# EAGLE design lambda_bl49 (EAGLE 8.5.1)
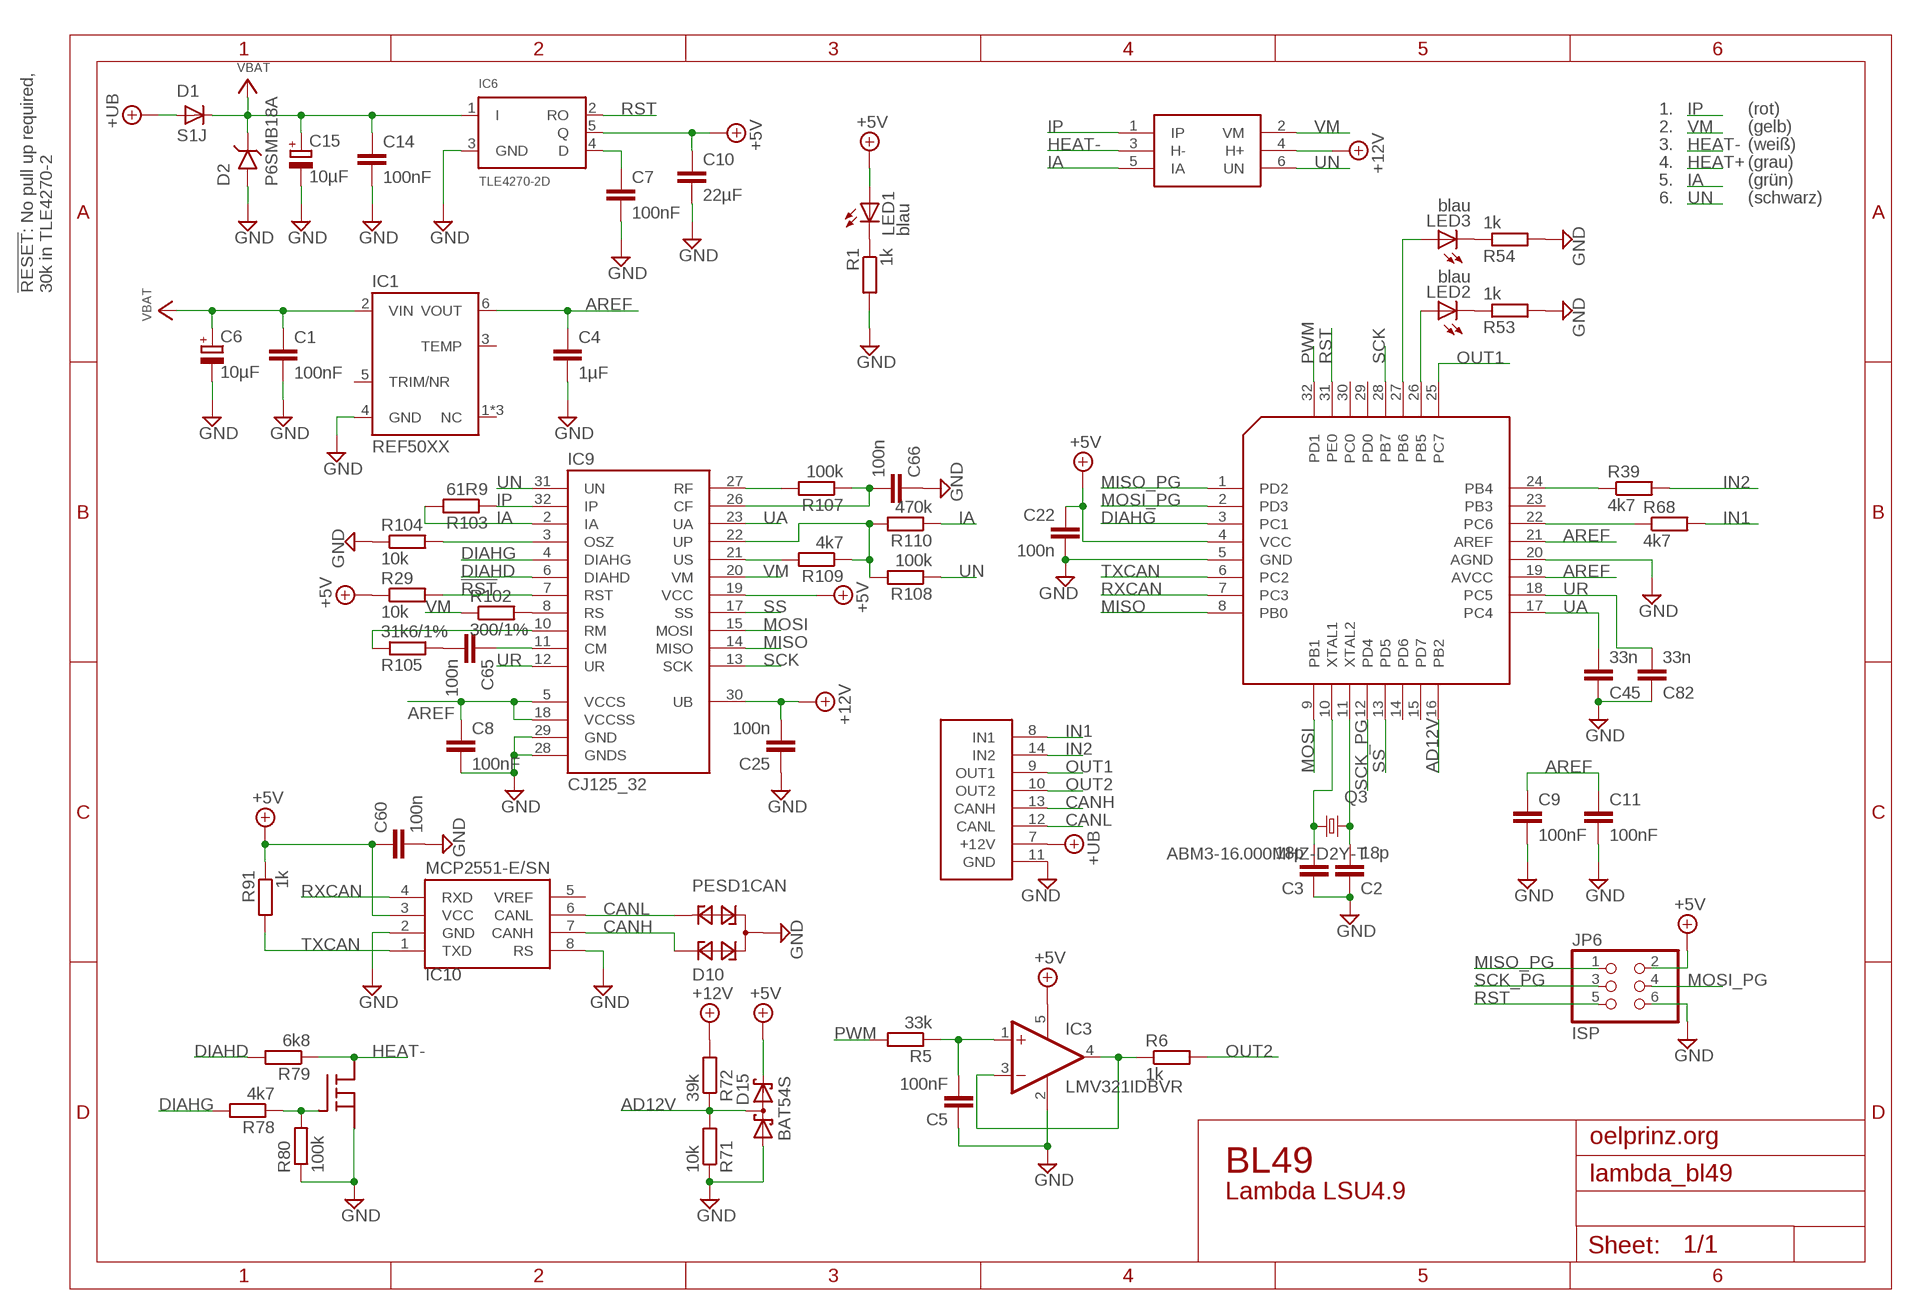
[diagram p0: schematic, sheet 1]

## Parts
C1  100nF  C-EUC0603  [C0603]
C2  18p  C-EUC0603  [C0603]
C3  18p  C-EUC0603  [C0603]
C4  1µF  C-EUC0603  [C0603]
C5  100nF  C-EUC0603  [C0603]
C6  10µF  CPOL-EUD  [PANASONIC_D]
C7  100nF  C-EUC0603  [C0603]
C8  100nF  C-EUC0603  [C0603]
C9  100nF  C-EUC0603  [C0603]
C10  22µF  C-EUC1206  [C1206]
C11  100nF  C-EUC0603  [C0603]
C14  100nF  C-EUC0603  [C0603]
C15  10µF  CPOL-EUD  [PANASONIC_D]
C22  100n  C-EUC0603  [C0603]
C25  100n  C-EUC0603  [C0603]
C45  33n  C-EUC0603  [C0603]
C60  100n  C-EUC0603  [C0603]
C65  100n  C-EUC0603  [C0603]
C66  100n  C-EUC0603  [C0603]
C82  33n  C-EUC0603  [C0603]
D1  S1J  DIODESMA  [SMADIODE]
D2  P6SMB18A  P6SMBXXASMB  [DO-214AA]
D10  PESD1CAN  [SOT23]
D15  BAT54S  [SOT23]
IC1  REF50XX  [SOIC127P600X175-8N]
IC3  LMV321IDBVR  LMV321M7  [SC70-5L]
IC6  TLE4270-2D  [TO252-51]
IC9  CJ125_32  [TQFP32-08]
IC10  MCP2551-E/SN  MCP255  [SOIC8]
JP6  ISP  PINHD-2X3  [2X03]
LED1  blau  LEDSML0805  [SML0805]
LED2  blau  LEDSML0805  [SML0805]
LED3  blau  LEDSML0805  [SML0805]
Q3  ABM3-16.000MHZ-D2Y-T  ABM3-8.000MHZ-D2Y-T  [ABM3]
R1  1k  R-EU_R0603  [R0603]
R5  33k  R-EU_R0603  [R0603]
R6  1k  R-EU_R0603  [R0603]
R29  10k  R-EU_R0603  [R0603]
R39  4k7  R-EU_R0603  [R0603]
R53  1k  R-EU_R0603  [R0603]
R54  1k  R-EU_R0603  [R0603]
R68  4k7  R-EU_R0603  [R0603]
R71  10k  R-EU_R0603  [R0603]
R72  39k  R-EU_R0603  [R0603]
R78  4k7  R-EU_R0603  [R0603]
R79  6k8  R-EU_R0603  [R0603]
R80  100k  R-EU_R0603  [R0603]
R91  1k  R-EU_R0603  [R0603]
R102  300/1%  R-EU_R0603  [R0603]
R103  61R9  R-EU_R0603  [R0603]
R104  10k  R-EU_R0603  [R0603]
R105  31k6/1%  R-EU_R0603  [R0603]
R107  100k  R-EU_R0603  [R0603]
R108  100k  R-EU_R0603  [R0603]
R109  4k7  R-EU_R0603  [R0603]
R110  470k  R-EU_R0603  [R0603]
U$1  BL49  [BL49]
U$2  ATMEGA32M1-AU  AT32M1  [TQFP32-08]
U$3  STD30NF06LT4  IRLZ44  [DPACK_2]

## Nets
!RST: IC9.7(RST) R29.2
+5V: C10.1 C22.1 C60.1 D15.2(C2) IC3.5(V+) IC6.5(Q) IC9.19(VCC) IC10.3(VCC) JP6.2 LED1.A R29.1 R91.1 U$2.4(VCC)
+12V: C25.2 IC9.30(UB) R72.2 U$1.4(H+)
+UB: D1.A U$1.7(+12V)
AD12V: D15.3(C1A2) R71.2 R72.1 U$2.16(PB2)
AREF: C4.1 C8.1 C9.1 C11.1 IC1.6(VOUT) IC9.5(VCCS) IC9.18(VCCSS) U$2.19(AVCC) U$2.21(AREF)
CANH: D10.1 IC10.7(CANH) U$1.13(CANH)
CANL: D10.2 IC10.6(CANL) U$1.12(CANL)
DIAHD: IC9.6(DIAHD) R79.2
DIAHG: IC9.4(DIAHG) R78.2 U$2.3(PC1)
GND: C1.2 C2.1 C3.1 C4.2 C5.1 C6.- C7.2 C8.2 C9.2 C10.2 C11.2 C14.2 C15.- C22.2 C25.1 C45.1 C60.2 C66.1 C82.1 D2.P$2(A) D10.3 D15.1(A1) IC1.4(GND) IC3.2(V-) IC6.3(GND) IC9.28(GNDS) IC9.29(GND) IC10.2(GND) IC10.8(RS) JP6.6 R1.2 R53.2 R54.2 R71.1 R80.1 R104.1 U$1.11(GND) U$2.5(GND) U$2.20(AGND) U$3.S
HEAT-: R79.1 U$1.3(H-) U$3.D
IA: IC9.2(IA) R103.2 R110.1 U$1.5(IA)
IN1: R68.2 U$1.8(IN1)
IN2: R39.2 U$1.14(IN2)
IP: IC9.32(IP) R103.1 U$1.1(IP)
MISO: IC9.14(MISO) U$2.8(PB0)
MISO_PG: JP6.1 U$2.1(PD2)
MOSI: IC9.15(MOSI) U$2.9(PB1)
MOSI_PG: JP6.4 U$2.2(PD3)
N$1: IC9.3(OSZ) R104.2
N$2: LED1.C R1.1
N$10: C7.1 IC6.4(D)
N$11: IC9.10(RM) R105.1
N$12: C5.2 IC3.1(+IN) R5.1
N$14: IC3.3(-IN) IC3.4(OUT) R6.1
N$16: C2.2 Q3.1 U$2.11(XTAL2)
N$20: C65.1 IC9.11(CM)
N$21: C3.2 Q3.2 U$2.10(XTAL1)
N$26: C65.2 R105.2
N$27: IC9.8(RS) R102.2
N$33: R39.1 U$2.24(PB4)
N$34: LED2.A U$2.26(PB5)
N$36: LED2.C R53.1
N$37: LED3.C R54.1
N$38: LED3.A U$2.27(PB6)
N$42: R68.1 U$2.22(PC6)
N$44: IC9.27(RF) R107.2
N$49: IC9.22(UP) R108.2 R109.1 R110.2
N$50: IC9.21(US) R109.2
N$51: R78.1 R80.2 U$3.G
N$52: C66.2 IC9.26(CF) R107.1
OUT1: U$1.9(OUT1) U$2.25(PC7)
OUT2: R6.2 U$1.10(OUT2)
PWM: R5.2 U$2.32(PD1)
RST: IC6.2(RO) JP6.5 U$2.31(PE0)
RXCAN: IC10.4(RXD) U$2.7(PC3)
SCK: IC9.13(SCK) U$2.28(PB7)
SCK_PG: JP6.3 U$2.12(PD4)
SS: IC9.17(SS) U$2.13(PD5)
TXCAN: IC10.1(TXD) R91.2 U$2.6(PC2)
UA: C45.2 IC9.23(UA) U$2.17(PC4)
UN: IC9.31(UN) R108.1 U$1.6(UN)
UR: C82.2 IC9.12(UR) U$2.18(PC5)
VBAT: C1.1 C6.+ C14.1 C15.+ D1.C D2.P$1(C) IC1.2(VIN) IC6.1(I)
VM: IC9.20(VM) R102.1 U$1.2(VM)
Unconnected: IC1.1(NC) IC1.3(TEMP) IC1.5(TRIM/NR) IC1.7(NC) IC1.8(NC) IC10.5(VREF) U$2.14(PD6) U$2.15(PD7) U$2.23(PB3) U$2.29(PD0) U$2.30(PC0)

## Notes on the sheet
- 1. | (rot)
- 2. | (gelb)
- 3. | (weiß)
- 4. | (grau)
- 5. | (grün)
- 6. | (schwarz)
- !RESET!: No pull up required, 
  30k in TLE4270-2
- BL49 | oelprinz.org
- Lambda LSU4.9

## Library data of the parts
C1 C4 C7-C11 C14 C25 = rcl:C-EU: CAPACITOR, European symbol; SPICEPREFIX: C
C2 C3 C5 C22 C45 C60 C65 C66 C82 = rcl:C-EU: CAPACITOR, European symbol
C6 C15 = rcl:CPOL-EU: POLARIZED CAPACITOR, European symbol; SPICEPREFIX: C
D1 = Heinrich:DIODE: Diode SMADIODE - SMA Surface Mount Package 20V 1A Schottky Diode Digikey (500mV @ 1A, 500uA Vr @ 20V): 641-1014-6-ND SOD-123 30V 500mA (430mV Vf, 130uA Vr @ 30V) Schottky Diode - Digikey: B0530W-FDICT-ND SOD-323 10V 570mA (380mV Vf, 3ns) Schottky Diode - Digikey: ZLLS410CT-ND SOD-523 30V 30mA Schottky Diode (RB751S-40TE61) - Digikey: RB751S-40TE61CT-ND SOT23-R/W - SOT23 Package (R = Solder Paste/Reflow Ovens, W = Hand-Soldering) BAT54Film 40V 300mA - Digikey: 497-7162-1-ND DO-1N4148 Through Hole Small Current Diode (any model)
D2 = Heinrich:P6SMBXXA: SMBxxAT3G TVS Diode The SMB series is designed to protect voltage sensitive components from high voltage, high energy transients. They have excellent clamping capability, high surge capability, low zener impedance and fast response time. The SMB series is supplied in ON Semiconductor?s exclusive, cost-effective, highly reliable SURMETIC? package and is ideally suited for use in communication systems, automotive, numerical controls, process controls, medical equipment, business machines, power supplies and many other industrial/consumer applications. http://www.onsemi.com/pub_link/Collateral/P6SMB6.8AT3-D.PDF <datasheet.pdf>
D10 = diode:PESD1CAN: CAN bus ESD protection diode Source: http://www.nxp.com/documents/data_sheet/PESD1CAN.pdf
D15 = diode:BAT54S: Schottky Diodes Pin connection corrected 2011-05-04 Source: Fairchild .. BAT54.pdf
IC1 = Heinrich:REF50XX: 3 Vpp/V Noise, 3 ppm/C Drift Precision Series Voltage Reference Source: Datasheet <http://www.ti.com/general/docs/lit/getliterature.tsp?genericPartNumber=REF5050&fileType=pdf>; DESCRIPTION: 3 Vpp/V Noise, 3 ppm/C Drift Precision Series Voltage Reference; HEIGHT: 1.75mm; MANUFACTURER_NAME: Texas Instruments; MANUFACTURER_PART_NUMBER: REF5050AIDR; MOUSER_PART_NUMBER: 595-REF5050AIDR; MOUSER_PRICE-STOCK: https://www.mouser.com/Search/Refine.aspx?Keyword=595-REF5050AIDR
IC3 = linear:LMV321?*: General Purpose, Low Voltage, Rail-to-Rail Output Operational Amplifiers Source: http://www.national.com/mpf/LM/LMV321.html http://www.national.com/dt/lmv_qual.pdf
IC6 = Heinrich:TLE4270-2
IC9 = cj125:CJ125_32
IC10 = MCP255:MCP255
JP6 = pinhead:PINHD-2X3: PIN HEADER
LED1-LED3 = led:LED: LED OSRAM: - CHIPLED LG R971, LG N971, LY N971, LG Q971, LY Q971, LO R971, LY R971 LH N974, LH R974 LS Q976, LO Q976, LY Q976 LO Q996 - Hyper CHIPLED LW Q18S LB Q993, LB Q99A, LB R99A - SideLED LS A670, LO A670, LY A670, LG A670, LP A670 LB A673, LV A673, LT A673, LW A673 LH A674 LY A675 LS A676, LA A676, LO A676, LY A676, LW A676 LS A679, LY A679, LG A679 - Hyper Micro SIDELED® LS Y876, LA Y876, LO Y876, LY Y876 LT Y87S - SmartLED LW L88C, LW L88S LB L89C, LB L89S, LG L890 LS L89K, LO L89K, LY L89K LS L896, LA L896, LO L896, LY L896 - TOPLED LS T670, LO T670, LY T670, LG T670, LP T670 LSG T670, LSP T670, LSY T670, LOP T670, LYG T670 LG T671, LOG T671, LSG T671 LB T673, LV T673, LT T673, LW T673 LH T674 LS T676, LA T676, LO T676, LY T676, LB T676, LH T676, LSB T676, LW T676 LB T67C, LV T67C, LT T67C, LS T67K, LO T67K, LY T67K, LW E67C LS E67B, LA E67B, LO E67B, LY E67B, LB E67C, LV E67C, LT E67C LW T67C LS T679, LY T679, LG T679 LS T770, LO T770, LY T770, LG T770, LP T770 LB T773, LV T773, LT T773, LW T773 LH T774 LS E675, LA E675, LY E675, LS T675 LS T776, LA T776, LO T776, LY T776, LB T776 LHGB T686 LT T68C, LB T68C - Hyper Mini TOPLED® LB M676 - Mini TOPLED Santana® LG M470 LS M47K, LO M47K, LY M47K Source: http://www.osram.convergy.de LUXEON: - LUMILED® LXK2-PW12-R00, LXK2-PW12-S00, LXK2-PW14-U00, LXK2-PW14-V00 LXK2-PM12-R00, LXK2-PM12-S00, LXK2-PM14-U00 LXK2-PE12-Q00, LXK2-PE12-R00, LXK2-PE12-S00, LXK2-PE14-T00, LXK2-PE14-U00 LXK2-PB12-K00, LXK2-PB12-L00, LXK2-PB12-M00, LXK2-PB14-N00, LXK2-PB14-P00, LXK2-PB14-Q00 LXK2-PR12-L00, LXK2-PR12-M00, LXK2-PR14-Q00, LXK2-PR14-R00 LXK2-PD12-Q00, LXK2-PD12-R00, LXK2-PD12-S00 LXK2-PH12-R00, LXK2-PH12-S00 LXK2-PL12-P00, LXK2-PL12-Q00, LXK2-PL12-R00 Source: www.luxeon.com KINGBRIGHT: KA-3528ASYC Source: www.kingbright.com
Q3 = ABM3:ABM3-8.000MHZ-D2Y-T
R1 R5 R6 R29 R39 R53 R54 R68 R71 R72 R78-R80 R91 R102-R105 R107-R110 = rcl:R-EU_: RESISTOR, European symbol
U$1 = bl49:BL49
U$2 = AT32M1:AT32M1
U$3 = irlz44:IRLZ44

## Net classes
1 +5V: width 0.381 mm
2 +3V3: width 0.229 mm

## Board
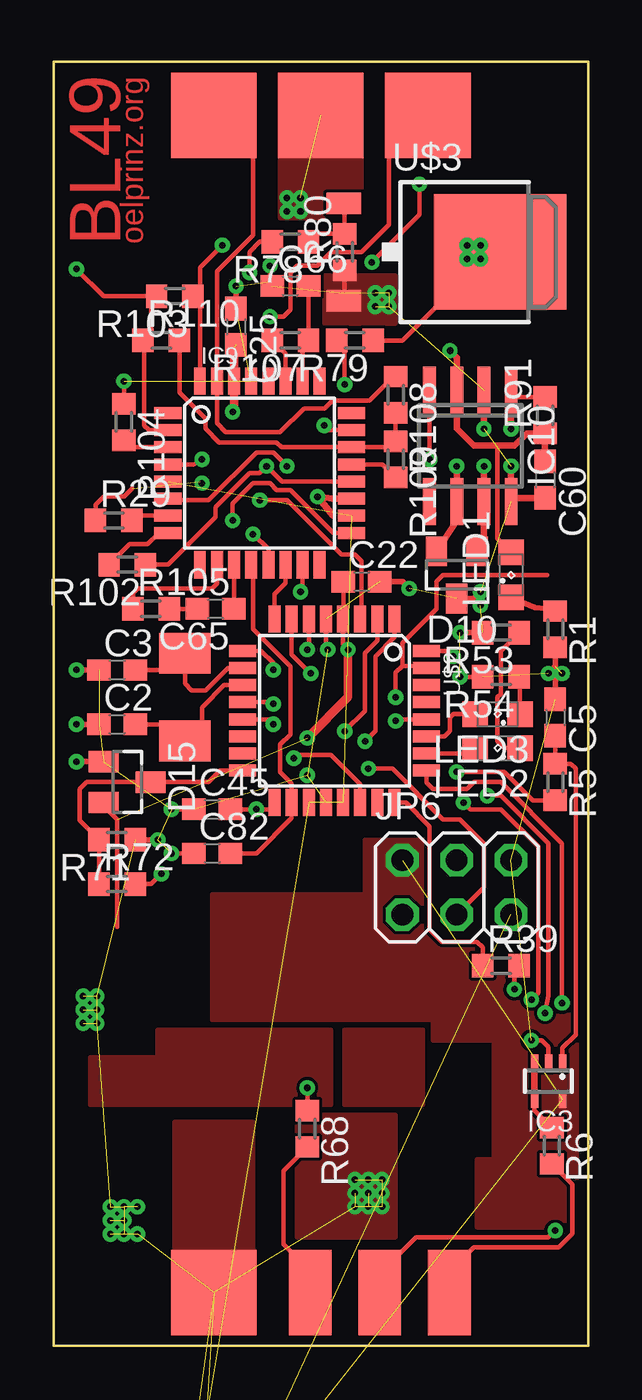
[diagram p1: board, top side]
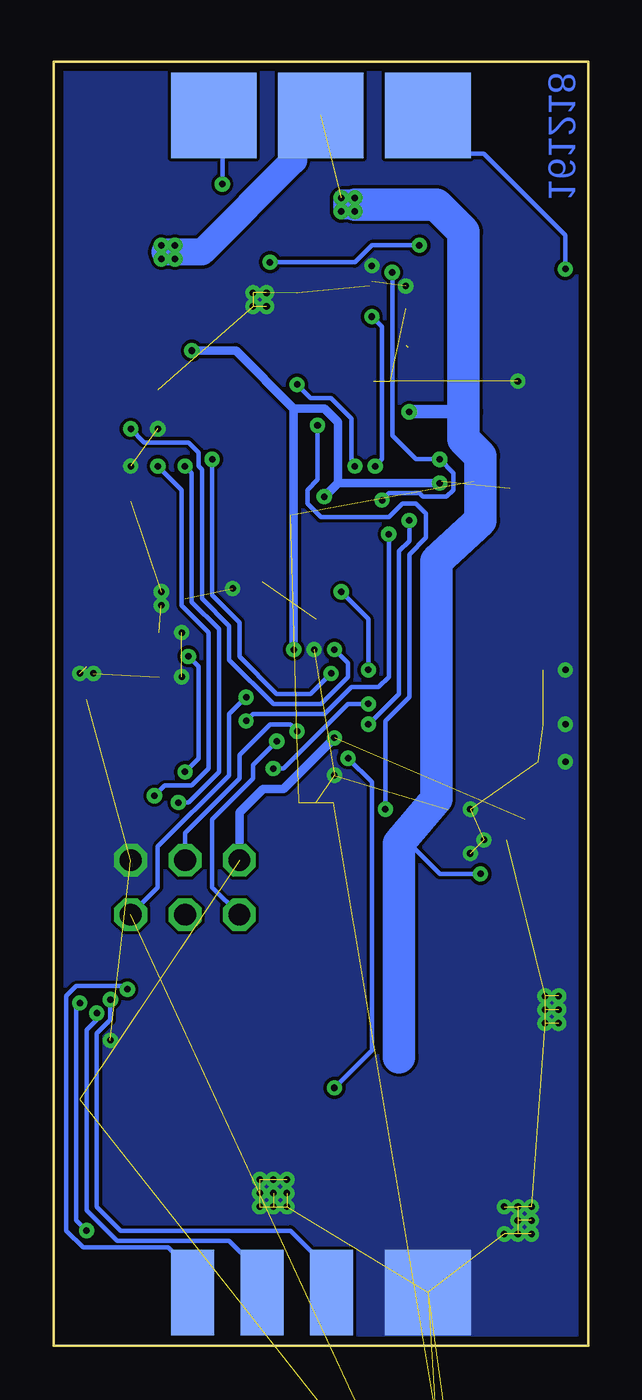
[diagram p2: board, bottom side, seen from below]

Size 25 x 60 mm. Coordinates in mm from the lower left corner, seen from the top.
Copper layers (1*16): Top 0.035mm / dielectric 0.2mm / Bottom 0.035mm
Design rules "default *": minimum track width 6mil, minimum drill 12mil, track to track 6mil, track to pad 6mil, pad to pad 6mil, via to via 6mil, smd to smd 6mil, copper to edge 15mil, drill to drill 8mil, minimum pad ring 10mil, minimum via ring 8mil, stop-mask expansion 4mil, vias tented up to drill 0mil, thermal gap 10mil

### Footprints (pad centres in the part's own frame; a part is rotated, then mirrored left to right if it is on the bottom)
C0603 = smd 1.1 x 1: 1 -0.85,0; 2 0.85,0
PANASONIC_D = smd 3 x 1.4: + 2.4,0; - -2.4,0
C1206 = smd 1.6 x 1.8: 1 -1.4,0; 2 1.4,0
SMADIODE = smd 2.54 x 2.54: A 2.349,0; C -2.349,0
DO-214AA = smd 2.159 x 2.743: P$1 -2.21,0; P$2 2.21,0
SOT23 = smd 1 x 1.4: 1 -0.95,-1.1; 2 0.95,-1.1; 3 0,1.1
SOIC127P600X175-8N = smd 1.525 x 0.7: 1 -2.712,1.905; 2 -2.712,0.635; 3 -2.712,-0.635; 4 -2.712,-1.905; 5 2.712,-1.905; 6 2.712,-0.635; 7 2.712,0.635; 8 2.712,1.905
SC70-5L = smd 0.35 x 0.8: 1 -0.65,-0.85; 2 0,-0.85; 3 0.65,-0.85; 4 0.65,0.85; 5 -0.65,0.85
TO252-51 = smd 1 x 1.6: 1 -2.28,-4.8; 2 -1.14,-4.8; 3 1.14,-4.8; 4 2.28,-4.8 | smd 5.4 x 6.2: 5 0,2.5
TQFP32-08 = smd 1.27 x 0.559: 1 -4.293,2.8; 2 -4.293,2; 3 -4.293,1.2; 4 -4.293,0.4; 5 -4.293,-0.4; 6 -4.293,-1.2; 7 -4.293,-2; 8 -4.293,-2.8; 17 4.293,-2.8; 18 4.293,-2; 19 4.293,-1.2; 20 4.293,-0.4; 21 4.293,0.4; 22 4.293,1.2; 23 4.293,2; 24 4.293,2.8 | smd 0.559 x 1.27: 9 -2.8,-4.293; 10 -2,-4.293; 11 -1.2,-4.293; 12 -0.4,-4.293; 13 0.4,-4.293; 14 1.2,-4.293; 15 2,-4.293; 16 2.8,-4.293; 25 2.8,4.293; 26 2,4.293; 27 1.2,4.293; 28 0.4,4.293; 29 -0.4,4.293; 30 -1.2,4.293; 31 -2,4.293; 32 -2.8,4.293
SOIC8 = smd 0.6 x 2.2: 1 -1.905,-2.6; 2 -0.635,-2.6; 3 0.635,-2.6; 4 1.905,-2.6; 5 1.905,2.6; 6 0.635,2.6; 7 -0.635,2.6; 8 -1.905,2.6
2X03 = drill 1.016 octagon: 1 -2.54,-1.27; 2 -2.54,1.27; 3 0,-1.27; 4 0,1.27; 5 2.54,-1.27; 6 2.54,1.27
SML0805 = smd 1.2 x 1.2: A 1.05,0; C -1.05,0
ABM3 = smd 1.9 x 2.4: 1 -2.05,0; 2 2.05,0
R0603 = smd 1 x 1.1: 1 -0.85,0; 2 0.85,0
BL49 = smd 4 x 4 bottom: 1 5,27.5; 3 0,27.5; 5 -5,27.5; 11 -5,-27.5 | smd 4 x 4: 2 5,27.5; 4 0,27.5; 6 -5,27.5; 7 -5,-27.5 | smd 2 x 4: 8 -0.5,-27.5; 9 2.75,-27.5; 10 6,-27.5 | smd 2 x 4 bottom: 12 -0.5,-27.5; 13 2.75,-27.5; 14 6,-27.5
DPACK_2 = smd 5.4 x 6.2: D 0,2.5 | smd 1 x 1.6: G -2.28,-4.8; S 2.28,-4.8

### Placement (x,y rotation side)
C1  -0.73,-86.52 0 top  (outside the outline)
C2  2.97,29.05 0 top
C3  2.97,31.59 0 top
C4  -0.73,-99.22 0 top  (outside the outline)
C5  23.45,29.37 270 top
C6  15.67,-28.74 0 top  (outside the outline)
C7  -0.73,-73.82 0 top  (outside the outline)
C8  0.43,-48.42 0 top  (outside the outline)
C9  -0.52,-134.15 0 top  (outside the outline)
C10  -0.84,-128.43 0 top  (outside the outline)
C11  -0.52,-137.64 0 top  (outside the outline)
C14  -0.73,-61.12 0 top  (outside the outline)
C15  5.2,-36.04 0 top  (outside the outline)
C22  14.4,35.72 0 top
C25  8.53,47.62 270 top
C45  7.42,25.08 0 top
C60  22.98,40.48 270 top
C65  7.58,34.45 180 top
C66  11.07,49.53 0 top
C82  7.42,23.02 0 top
D1  -4.65,-152.88 0 top  (outside the outline)
D2  -6.87,-145.26 0 top  (outside the outline)
D10  18.85,36.03 180 top
D15  3.45,26.35 270 top
IC1  2.02,-145.26 0 top  (outside the outline)
IC3  23.14,12.38 180 top
IC6  2.97,-17.31 0 top  (outside the outline)
IC9  9.64,40.8 0 top
IC10  19.48,42.06 180 top
JP6  18.85,21.43 0 top
LED1  21.39,36.03 90 top
LED2  20.75,27.94 180 top
LED3  20.75,29.52 180 top
Q3  6.15,30.32 90 top
R1  23.45,33.49 270 top
R5  23.45,26.35 270 top
R6  23.29,9.36 270 top
R29  2.82,38.57 0 top
R39  20.91,17.78 0 top
R53  20.91,33.33 180 top
R54  20.91,31.27 180 top
R68  11.87,10.16 270 top
R71  2.97,23.65 180 top
R72  2.97,21.59 0 top
R78  11.07,51.59 180 top
R79  14.09,46.99 180 top
R80  13.61,51.11 90 top
R91  22.98,43.49 90 top
R102  3.45,36.51 180 top
R103  5.67,49.05 180 top
R104  3.29,43.18 270 top
R105  4.56,34.45 0 top
R107  11.07,46.99 180 top
R108  15.99,44.45 270 top
R109  15.99,41.43 270 top
R110  5.04,46.99 0 top
U$1  12.5,30 0 top
U$2  13.13,29.68 270 top
U$3  18.37,51.11 270 top

### Tracks (layer width: path | path; a pad name or v marks a point on that pad's centre or on a via)
!RST
  Top 0.203: IC9.7 4.05,38.8 R29.2
+5V  (via drill 0.3)  (5 unrouted)
  Top 0.203: C22.1 13.56,34 U$2.4 13.54,32.77 v13.77,32.54 | R29.1 1.97,39.31 2.34,39.68 3.29,39.68 3.67,40.06 | 20.75,42.06 20.75,37.72 LED1.A 21.67,37.36 | D15.2 2.18,25.4 2.97,24.6 2.97,19.58
  Top 0.305: 6.86,40.4 v6.94,40.32 | IC9.19 13.05,39.59 v12.34,39.68 13.07,38.8 | v18.53,46.51 18.85,46.19 IC10.3 18.85,42.86 19.64,42.06 20.75,42.06 21.55,42.06 22.13,42.64 R91.1 C60.1
  Top 0.406: v13.77,32.54 13.77,30.32 v11.87,28.41
  Bottom 0.406: v6.94,40.32 11.71,40.32 | v12.34,39.68 11.71,40.32 | 11.71,40.32 11.71,43.18 12.34,43.81 13.77,43.81 | 13.77,43.81 v13.77,32.54 | v11.87,28.41 14.25,26.03 15.2,26.03 16.31,24.92 JP6.2 | v18.53,46.51 16.47,46.51 13.77,43.81
  pour Top (no thermals): 7.42,21.11 7.42,15.24 17.74,15.24 17.74,14.28 20.6,14.28 20.6,8.73 19.8,8.73 19.8,5.55 24.88,5.55 24.88,17.3 19.8,17.3 19.8,18.89 18.21,18.89 17.58,19.52 17.58,23.65 14.56,23.65 14.56,21.11
+12V  (via drill 0.3)  (2 unrouted)
  Top 0.203: R72.2 4.56,21.59 v5.04,22.06
  Top 0.406: 8.44,46.68 IC9.30 8.44,43.72 v8.37,43.65
  Bottom 0.203: 8.66,23.71 8.28,23.33 8.21,23.33 6.94,22.06 v5.04,22.06
  Bottom 0.635: 5.83,43.65 v8.37,43.65
  Bottom 0.762: v11.55,53.65 10.91,53.34 v10.91,53.02 v11.55,53.02 v11.55,53.65 | v10.91,53.65 v11.55,53.65
  Bottom 1.524: 8.85,13.49 8.85,23.49 8.66,23.71 7.1,25.55 7.1,36.67 5.04,38.57 5.04,41.59 5.83,42.38 5.83,43.65 5.83,52.07 7.1,53.34 10.91,53.34
  pour Top (no thermals): 12.98,11.27 1.7,11.27 1.7,13.49 4.88,13.49 4.88,14.76 12.98,14.76
  pour Top (no thermals): 10.59,56.04 10.59,52.7 14.4,52.7 14.4,56.04
+UB  (1 unrouted)
  pour Top (no thermals): 9.32,4.28 9.32,10.47 5.67,10.47 5.67,4.28
AD12V
  Top 0.203: R72.1 R71.2 1.23,24.55 1.23,26.03 1.55,26.35 D15.3 7.26,26.35 7.8,26.88 U$2.16
AREF  (8 unrouted)
CANH  (via drill 0.3)
  Top 0.203: v20.28,25.71 20.91,25.71 23.14,23.49 23.14,16.35 v22.98,15.55
  Top 0.305: D10.1 20.12,37.61 IC10.7 v20.12,41.11
  Bottom 0.203: v20.12,41.11 19.01,40 19.01,34.6 17.74,33.33 17.74,26.98 18.53,26.19 19.8,26.19 v20.28,25.71 | v22.98,15.55 22.98,15.24 23.45,14.76 23.45,6.35 22.02,4.92 16.79,4.92 15.5,3.63 U$1.13
CANL  (via drill 0.3)
  Top 0.203: v19.17,25.4 19.48,25.08 20.91,25.08 22.66,23.33 22.66,16.51 v22.34,16.19
  Top 0.305: D10.2 18.85,38.56 IC10.6 v18.85,41.11
  Bottom 0.203: v18.85,41.11 18.53,40.8 18.53,34.76 17.26,33.49 17.26,26.83 18.69,25.4 v19.17,25.4 | v22.34,16.19 22.34,15.24 22.98,14.6 22.98,6.51 21.87,5.39 13.93,5.39 12.02,3.49 U$1.12
DIAHD  (via drill 0.3)
  Top 0.203: v10.91,41.11 10.28,41.75 9.48,41.75 7.26,39.52 5.42,39.52 IC9.6 | v13.61,44.92 13.61,46.61 R79.2
  Bottom 0.203: v13.61,44.92 12.98,44.29 12.02,44.29 11.07,43.34 11.07,41.27 v10.91,41.11
DIAHG  (via drill 0.3)
  Top 0.203: IC9.4 6.54,41.2 v6.94,41.43 | U$2.3 14.33,34.06 14.4,34.13 14.4,36.67 14.09,36.98 13.45,36.98 10.91,39.52 v9.64,39.52 | R78.2 9.64,51.59 9.17,51.11 v9.17,50.16
  Bottom 0.203: v9.17,50.16 9.17,42.54 8.06,41.43 v6.94,41.43 6.31,40.8 6.31,40 6.63,39.68 7.74,39.68 7.9,39.84 9.32,39.84 v9.64,39.52
GND  (via drill 0.3)  (65 unrouted)
  Top 0.203: R104.1 v3.29,45.08 | v10.12,50.48 10.12,49.74 C66.1 | v5.51,25.08 C45.1 | v5.51,23.02 C82.1 | U$2.5 12.73,32.94 v12.82,32.54 | R80.1 13.61,49.19 U$3.S | v19.01,31.27 R54.2 | IC3.2 23.14,13.97 22.82,14.28 v22.34,14.28
  Top 0.254: C25.1 v8.53,49.53 | C22.2 16.31,35.72 v16.63,35.4 | R71.1 v4.88,23.65 | v1.07,27.3 D15.1 | v19.01,33.33 R53.2 | 18.86,34.92 19.64,34.92 | 19.64,34.92 v19.96,35.24 | 19.64,34.92 v19.96,34.6 | C5.1 23.45,31.11 v23.77,31.43 | C3.1 v1.07,31.59 | C2.1 v1.07,29.05 | R1.2 23.45,31.75 v23.14,31.43
  Top 0.305: v20.12,42.86 IC10.2 | v21.39,41.11 IC10.8 21.55,39.63 C60.2 | 18.86,34.92 D10.3
  other vias: 15.67,48.57 15.04,48.57 11.87,26.67 15.04,49.21 15.67,49.21 14.72,6.51 14.09,6.51 14.72,7.14 14.09,7.14 15.36,7.14 15.36,6.51 14.09,7.78 14.72,7.78 15.36,7.78 2.02,16.35 2.02,15.71 2.02,15.08 1.39,16.35 1.39,15.71 1.39,15.08 2.66,6.51 3.29,6.51 3.93,6.51 2.66,5.87 3.29,5.87 2.66,5.24 3.29,5.24 3.93,5.24
  pour Bottom (no thermals): 0.12,59.84 0.12,0.16 24.88,0.16 24.88,59.84
  pour Top (no thermals): 12.66,47.78 12.66,50 15.99,50 15.99,47.78
  pour Top (no thermals): 15.99,5.08 15.99,10.79 11.39,10.79 11.39,5.08
HEAT-  (via drill 0.3)
  Top 0.203: R79.1 16.31,46.99 19.33,50 v19.33,50.8 v19.96,50.8 v19.96,51.43 | v19.33,51.43 v19.96,51.43 | v19.96,51.43 20.56,51.43 U$3.D
  Bottom 0.203: 19.8,51.11 19.8,51.27 v19.96,51.43
  Bottom 1.27: U$1.3 12.62,57.5 13.77,56.35 13.77,55.4 18.06,51.11 19.8,51.11
IA  (via drill 0.3)
  Top 0.203: IC9.2 4.47,42.8 4.25,43.02 4.25,46.83 R110.1 4.25,46.99 4.4,47.15 4.56,47.15 4.56,48.79 R103.2 2.34,49.05 v1.07,50.32
  Bottom 0.203: v1.07,50.32 1.07,51.91 4.88,55.72 5.83,55.72 5.83,55.83 U$1.5
IN1
  Top 0.203: U$1.8 12,3.51 10.75,4.76 10.75,8.2 R68.2
IN2  (via drill 0.3)
  Top 0.203: v21.55,16.67 21.55,17.56 R39.2
  Bottom 0.203: v21.55,16.67 21.71,16.82 23.93,16.82 24.41,16.35 24.41,5.39 23.61,4.6 19.64,4.6 18.5,3.46 U$1.14
IP  (via drill 0.3)
  Top 0.203: v7.9,51.43 6.84,50.38 6.84,49.37 R103.1 | R103.1 | IC9.32 6.84,48.73 R103.1 | v14.88,50.64 17.1,52.86 v17.1,54.29
  Bottom 0.203: v7.9,51.43 10.12,51.43 10.91,50.64 v14.88,50.64 | U$1.1 17.5,56.59 17.1,56.19 v17.1,54.29
MISO
  Top 0.203: IC9.14 10.84,35.65 10.33,35.14 U$2.8
MISO_PG  (via drill 0.3)
  Top 0.203: v14.56,28.25 15.04,28.73 15.04,32.22 15.94,33.12 U$2.1
  Bottom 0.203: v14.56,28.25 15.67,27.14 15.67,26.51 17.58,24.6 17.58,21.43 JP6.1
MOSI  (via drill 0.3)
  Top 0.203: U$2.9 9.7,32.48 10.28,31.91 v10.28,31.59 | IC9.15 11.64,35.33 v11.55,35.24
  Bottom 0.203: v11.55,35.24 10.28,33.97 v10.28,31.59
MOSI_PG  (via drill 0.3)
  Top 0.203: U$2.2 15.14,32.95 14.56,32.38 14.56,29.68 v13.61,28.73
  Bottom 0.203: v13.61,28.73 13.93,29.05 14.88,29.05 16.31,27.62 16.31,26.51 18.85,23.97 JP6.4
N$1
  Top 0.203: IC9.3 3.62,42 R104.2
N$2
  Top 0.254: R1.1 23.4,34.34 23.29,34.45 22.5,34.51 LED1.C
N$3  (via drill 0.3)
  other vias: 5.04,22.06
N$10  (1 unrouted)
N$11
  Top 0.203: R105.1 3.71,35.18 3.93,35.4 7.42,35.4 7.64,35.62 IC9.10
N$12
  Top 0.203: IC3.1 23.79,13.93 24.41,14.55 24.41,26.98 24.19,27.2 R5.1 C5.2
N$14
  Top 0.203: IC3.4 22.49,11.02 R6.1
  Top 0.305: IC3.3 IC3.4
N$16
  Top 0.203: C2.2 5.37,29.05 Q3.1 6.96,28.27 6.94,28.25 6.94,29.84 7.98,30.88 U$2.11
N$20
  Top 0.203: IC9.11 8.44,34.59 C65.1
N$21
  Top 0.203: C3.2 5.37,31.59 Q3.2 6.84,31.68 6.15,31.91 6.15,30.95 6.47,30.64 7.1,30.64 8.15,31.68 U$2.10
N$26
  Top 0.203: R105.2 C65.2
N$27
  Top 0.203: IC9.8 4.94,38 4.4,37.46 3.55,37.46 R102.2
N$33
  Top 0.203: U$2.24 16.48,25.39 17.58,24.29 17.58,19.47 18.16,18.89 19.8,18.89 20.06,18.63 R39.1
N$34
  Top 0.203: U$2.26 19.32,27.68 LED2.A
N$36
  Top 0.203: LED2.C 21.07,27.94 20.75,28.25 20.75,30.32 20.91,30.48 20.91,32.48 R53.1
N$37
  Top 0.203: LED3.C 21.81,30.75 R54.1
N$38
  Top 0.203: U$2.27 18.29,28.48 18.53,28.73 18.53,29.37 18.69,29.52 LED3.A
N$42  (via drill 0.3)
  Top 0.203: v11.23,27.46 11.39,27.62 12.98,27.62 14.33,26.26 U$2.22 | v11.87,12.06 R68.1
  Bottom 0.203: v11.23,27.46 10.12,26.35 10.12,13.81 v11.87,12.06
N$44
  Top 0.203: IC9.27 10.84,46.37 R107.2
N$49
  Top 0.203: R108.2 R109.1 15.71,42 IC9.22 10.66,42 10.44,42.22 7.74,42.22 7.1,42.86 7.1,43.34 5.89,44.55 R110.2
N$50
  Top 0.203: IC9.21 15.38,41.2 R109.2
N$51
  Top 0.203: U$3.G 13.61,53.2 R80.2 12.14,51.96 R78.1
N$52
  Top 0.203: IC9.26 11.64,46.71 R107.1 C66.2
N$53
  pour Top (no thermals): 17.26,11.27 13.61,11.27 13.61,14.76 17.26,14.76
OUT1  (via drill 0.3)
  Top 0.203: U$2.25 17.43,26.34 17.74,26.03 19.33,26.03 19.64,26.35 20.91,26.35 23.77,23.49 v23.77,16.03 | v23.45,5.39 23.14,5.08 16.95,5.08 15.34,3.47 U$1.9
  Bottom 0.203: v23.77,16.03 23.93,15.87 23.93,5.87 v23.45,5.39
OUT2
  Top 0.203: R6.2 24.25,7.56 24.25,5.24 23.61,4.6 19.64,4.6 18.5,3.46 U$1.10
PWM  (via drill 0.3)
  Top 0.203: v18.85,26.83 21.07,26.83 22.4,25.5 R5.2 | U$2.32 18.43,32.48 v18.69,32.22
  Bottom 0.203: v18.69,32.22 18.22,31.75 18.22,27.46 v18.85,26.83
RST  (via drill 0.3)  (1 unrouted)
  Top 0.203: v15.99,30.32 15.99,31.46 16.31,31.78 | 23.08,36.03 18.22,36.03 17.9,35.72 17.9,34.45 16.31,32.86 16.31,31.78 | 16.31,31.78 17.33,31.78 U$2.31
  Bottom 0.203: v15.99,30.32 16.79,29.52 16.79,26.67 20.12,23.33 20.12,21.43 JP6.5
RXCAN  (via drill 0.3)
  Top 0.203: IC10.4 v17.58,41.43 | U$2.7 11.14,32.32 v12.02,31.43
  Bottom 0.203: v12.02,31.43 12.98,30.48 14.56,30.48 16.31,32.22 16.31,33.81 17.58,35.08 v17.58,41.43
SCK  (via drill 0.3)
  Top 0.203: IC9.13 10.04,37.23 v9.32,37.94 | U$2.28 16.07,29.28 v15.99,29.21
  Bottom 0.203: v9.32,37.94 9.32,31.27 9.8,30.79 11.07,30.79 12.34,29.52 15.67,29.52 v15.99,29.21
SCK_PG  (via drill 0.3)
  Top 0.203: U$2.12 10.2,30.08 v10.28,30 | JP6.3 20.12,21.43 20.12,23.49 19.01,24.6 18.22,24.6 15.83,26.98 v14.72,26.98
  Bottom 0.203: v10.28,30 11.23,30 14.25,26.98 v14.72,26.98
SS  (via drill 0.3)
  Top 0.203: 14.02,38 IC9.17 13.08,38 11.07,40 10.44,40 10.12,40.32 9.32,40.32 8.37,39.37 v8.37,38.57 | U$2.13 10.04,29.28 v10.28,29.05
  Bottom 0.203: v8.37,38.57 8.37,37.62 8.85,37.14 8.85,30.48 v10.28,29.05
TXCAN  (via drill 0.3)
  Top 0.203: U$2.6 11.94,32.93 v11.87,32.54 | R91.2 21.39,44.34 IC10.1
  Top 0.305: 21.39,44.34 v21.39,42.86
  Bottom 0.203: v11.87,32.54 11.23,31.91 11.23,31.27 12.5,30 14.72,30 16.79,32.06 16.79,33.65 18.06,34.92 18.06,40.95 18.22,41.11 18.22,41.75 18.69,42.22 20.75,42.22 v21.39,42.86
UA  (via drill 0.3)
  Top 0.203: IC9.23 12.88,42.8 v12.66,43.02 | U$2.17 10.33,25.08 v9.48,25.08 C45.2
  Bottom 0.203: v12.66,43.02 12.66,40.48 13.14,40 13.14,39.37 12.5,38.73 9.32,38.73 8.69,39.37 8.06,39.37 7.58,38.89 7.58,37.78 8.37,36.98 8.37,30.32 9.48,29.21 v9.48,25.08
UN
  Top 0.203: R108.1 15.83,45.24 14.78,44.19 13.03,44.19 12.66,43.81 11.71,43.81 10.59,42.7 8.06,42.7 7.64,43.11 IC9.31 7.64,50.23 9.32,51.91 9.32,55.72 7.74,56.67 7.26,56.76 U$1.6
UR
  Top 0.203: C82.2 9.48,23.02 11.14,24.67 U$2.18 11.14,26.29 10.59,26.83 10.59,28.1 11.07,28.57 11.07,31.75 9.32,33.49 9.32,36.42 IC9.12
VBAT  (7 unrouted)
VM  (via drill 0.3)
  Top 0.203: R102.1 5.36,36.51 7.58,38.73 7.58,39.21 9.17,40.8 9.64,40.8 v9.96,41.11 10.68,40.4 IC9.20 | v10.12,48.1 10.75,48.1 11.07,48.41 11.07,50.16 11.39,50.48 12.34,50.48 12.98,51.11 14.4,51.11 15.67,52.38 15.67,55.81 U$1.2
  Bottom 0.203: v9.96,41.11 9.64,41.43 9.64,47.62 v10.12,48.1

### Text on the board
Top: BL49 | oelprinz.org
Bottom: 161218